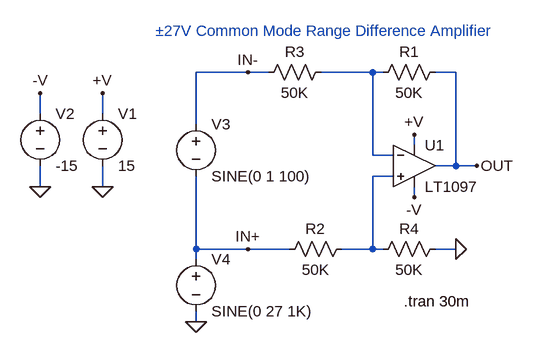
[diagram p0: schematic 1097.asc]
1097.asc, the LTspice schematic file:
Version 4
SHEET 1 896 680
WIRE -64 96 -144 96
WIRE -32 96 -64 96
WIRE 128 96 48 96
WIRE 144 96 128 96
WIRE 256 96 224 96
WIRE -384 160 -384 128
WIRE -288 160 -288 128
WIRE -144 176 -144 96
WIRE 192 208 192 192
WIRE 128 224 128 96
WIRE 160 224 128 224
WIRE 256 240 256 96
WIRE 256 240 224 240
WIRE 288 240 256 240
WIRE 160 256 128 256
WIRE -384 272 -384 240
WIRE -288 272 -288 240
WIRE 192 288 192 272
WIRE -144 368 -144 256
WIRE -64 368 -144 368
WIRE 0 368 -64 368
WIRE 128 368 128 256
WIRE 128 368 80 368
WIRE 144 368 128 368
WIRE 256 368 224 368
WIRE -144 384 -144 368
WIRE -144 480 -144 464
FLAG -288 272 0
FLAG 192 192 +V
FLAG -288 128 +V
FLAG 192 288 -V
FLAG -384 272 0
FLAG -384 128 -V
FLAG -144 480 0
FLAG 256 368 0
FLAG 288 240 OUT
FLAG -64 96 IN-
FLAG -64 368 IN+
SYMBOL voltage -288 144 R0
SYMATTR InstName V1
SYMATTR Value 15
SYMBOL voltage -384 144 R0
SYMATTR InstName V2
SYMATTR Value -15
SYMBOL res 240 80 R90
WINDOW 0 0 56 VBottom 0
WINDOW 3 32 56 VTop 0
SYMATTR InstName R1
SYMATTR Value 50K
SYMBOL voltage -144 160 R0
SYMATTR InstName V3
SYMATTR Value SINE(0 1 100)
SYMBOL opamps\\LT1097 192 176 R0
SYMATTR InstName U1
SYMBOL res 64 80 R90
WINDOW 0 0 56 VBottom 0
WINDOW 3 32 56 VTop 0
SYMATTR InstName R3
SYMATTR Value 50K
SYMBOL res 96 352 R90
WINDOW 0 0 56 VBottom 0
WINDOW 3 32 56 VTop 0
SYMATTR InstName R2
SYMATTR Value 50K
SYMBOL res 240 352 R90
WINDOW 0 0 56 VBottom 0
WINDOW 3 32 56 VTop 0
SYMATTR InstName R4
SYMATTR Value 50K
SYMBOL voltage -144 368 R0
SYMATTR InstName V4
SYMATTR Value SINE(0 27 1K)
TEXT 176 448 Left 0 !.tran 30m
TEXT 56 48 Bottom 0 ;±27V Common Mode Range Difference Amplifier

The netlist it stands for:
* 1097.asc
V1 +V 0 15
V2 -V 0 -15
R1 OUT N001 50K
V3 IN- IN+ SINE(0 1 100)
XU1 N002 N001 +V -V OUT LT1097  ; pins In+ In- V+ V- OUT
R3 N001 IN- 50K
R2 N002 IN+ 50K
R4 0 N002 50K
V4 IN+ 0 SINE(0 27 1K)
.tran 30m
* ±27V Common Mode Range Difference Amplifier
.backanno
.end